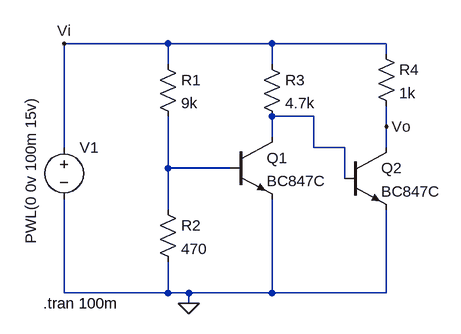
[diagram p0: schematic NPN.asc]
NPN.asc, the LTspice schematic file:
Version 4
SHEET 1 880 680
WIRE 128 -32 -32 -32
WIRE 288 -32 128 -32
WIRE 464 -32 288 -32
WIRE 464 -16 464 -32
WIRE 128 0 128 -32
WIRE 288 0 288 -32
WIRE 352 80 288 80
WIRE 464 96 464 64
WIRE 288 112 288 80
WIRE -32 128 -32 -32
WIRE 352 128 352 80
WIRE 400 128 352 128
WIRE 464 128 464 96
WIRE 128 160 128 80
WIRE 224 160 128 160
WIRE 400 176 400 128
WIRE 128 224 128 160
WIRE -32 352 -32 208
WIRE 128 352 128 304
WIRE 128 352 -32 352
WIRE 160 352 128 352
WIRE 288 352 288 208
WIRE 288 352 160 352
WIRE 464 352 464 224
WIRE 464 352 288 352
WIRE 160 368 160 352
FLAG 160 368 0
FLAG -32 -32 Vi
FLAG 464 96 Vo
SYMBOL voltage -32 112 R0
WINDOW 3 -51 -62 VRight 2
WINDOW 123 0 0 Left 0
WINDOW 39 0 0 Left 0
SYMATTR InstName V1
SYMATTR Value PWL(0 0v 100m 15v)
SYMBOL res 112 -16 R0
SYMATTR InstName R1
SYMATTR Value 9k
SYMBOL res 112 208 R0
SYMATTR InstName R2
SYMATTR Value 470
SYMBOL npn 224 112 R0
SYMATTR InstName Q1
SYMATTR Value BC847C
SYMBOL npn 400 128 R0
SYMATTR InstName Q2
SYMATTR Value BC847C
SYMBOL res 272 -16 R0
SYMATTR InstName R3
SYMATTR Value 4.7k
SYMBOL res 448 -32 R0
SYMATTR InstName R4
SYMATTR Value 1k
TEXT -64 368 Left 2 !.tran 100m

The netlist it stands for:
* NPN.asc
V1 Vi 0 PWL(0 0v 100m 15v)
R1 Vi N002 9k
R2 N002 0 470
Q1 N001 N002 0 0 BC847C
Q2 Vo N001 0 0 BC847C
R3 Vi N001 4.7k
R4 Vi Vo 1k
.model NPN NPN
.model PNP PNP
.lib standard.bjt
.tran 100m
.backanno
.end